# Altium schematic sheet 22uH.schdoc
size 127 x 99 mm
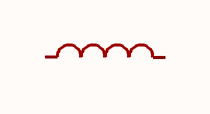
[diagram p0: 22uH.schdoc]

## Parts
L?  22uH  [IND-SMD_L5.5-W5.2]  (value not drawn)

## Nets

Not connected (* = marked no-connect by the designer): L? 1 2

## Library data of the parts
L? = SMMS0530-220M: Manufacturer: SXN(顺翔诺); Add into BOM: yes; Tolerance: ±20%; Rated Current: 1.8A; Saturation Current (Isat): 2A; DC Resistance (DCR): 394.8mΩ; Type: 一体成型电感; Symbol: SMMS0530-220M; Device: SMMS0530-220M; LCSC Part Name: 22uH ±20% 2A; Supplier Part: C2842153; Manufacturer Part: SMMS0530-220M; Supplier Footprint: SMD,5.5x5.2x3mm; JLCPCB Part Class: Extended Part; Datasheet: https://atta.szlcsc.com/upload/public/pdf/source/20210810/BBF24330FB2F5029F637830BA9C42C0D.pdf; Supplier: LCSC; Convert to PCB: yes; Value: 22uH; Ratings: -